# EAGLE design Lux_Meter (EAGLE 9.5.1)

## Sheet 1 of 2
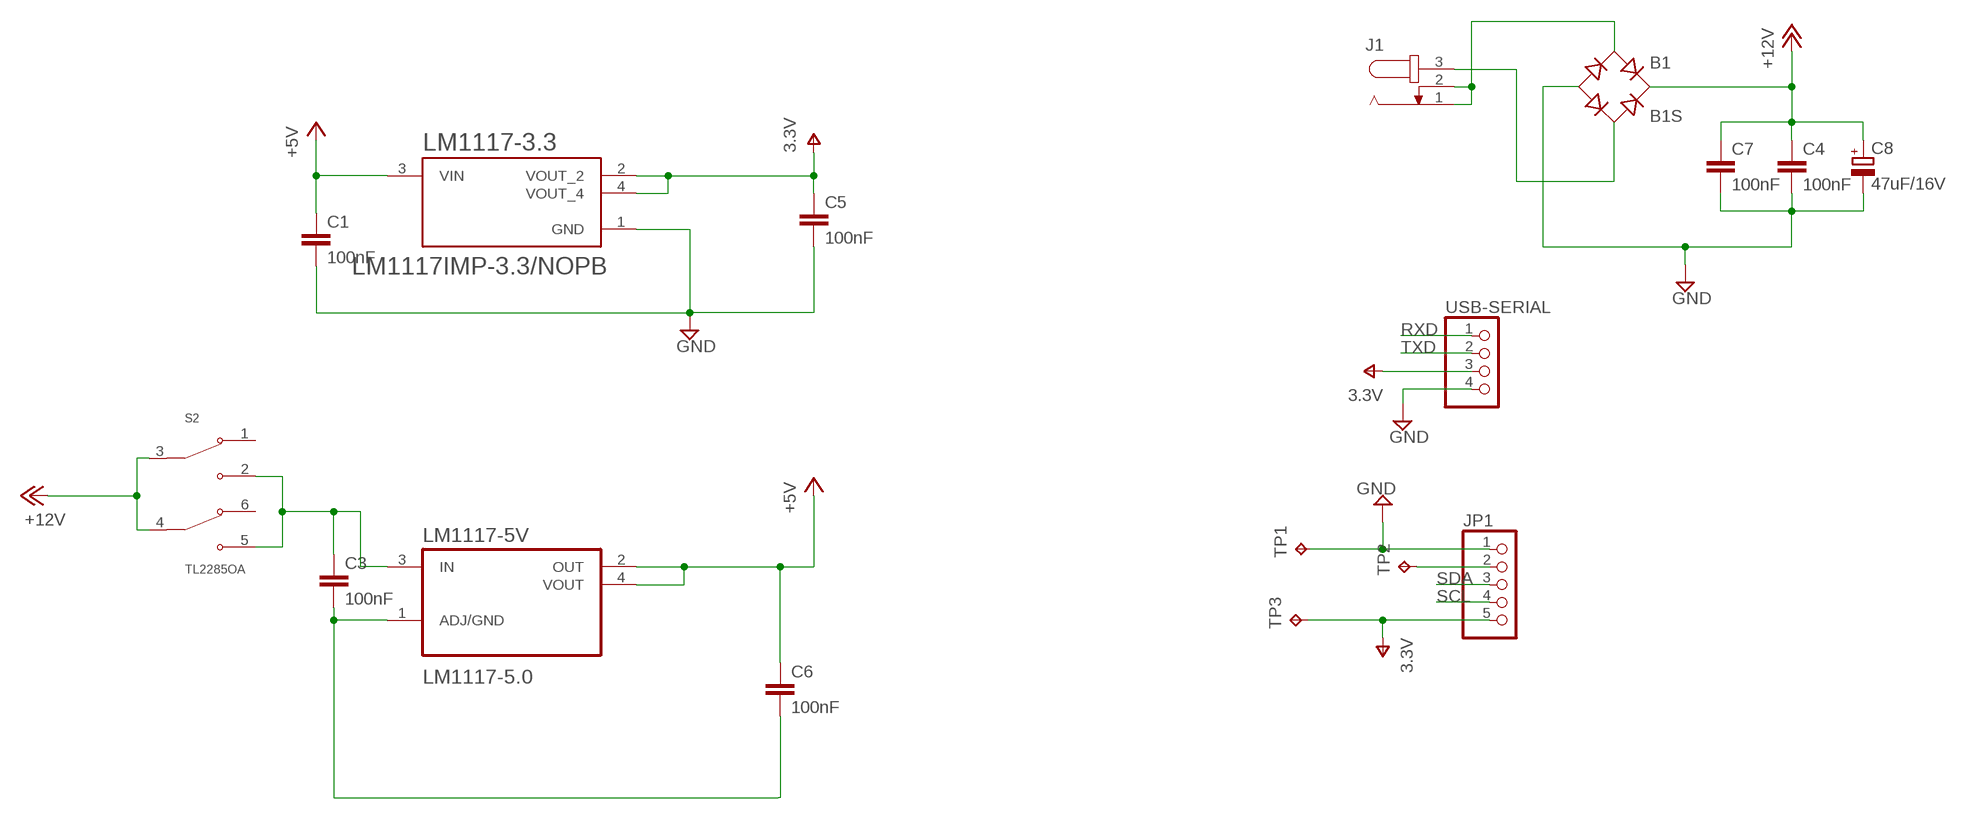
[diagram p0: schematic, sheet 1]

### Parts
B1  B1S  [MBS]
C1  100nF  C-EUC0603K  [C0603K]
C3  100nF  C-EUC0603K  [C0603K]
C4  100nF  C-EUC0603K  [C0603K]
C5  100nF  C-EUC0805K  [C0805K]
C6  100nF  C-EUC0805K  [C0805K]
C7  100nF  C-EUC0805K  [C0805K]
C8  47uF/16V  CPOL-EUC/6032-28R  [C/6032-28R]
J1  JACK-PLUG0  [SPC4077]
JP1  PINHD-1X5  [1X05]
LM1117-3.3  LM1117IMP-3.3/NOPB  [VREG_LM1117IMP-3.3/NOPB]
LM1117-5V  LM1117-5.0  LM1117MP-5.0  [SOT230P700X180-4N]
S2  TL2285OA  [SW_TL2285OA]
TP1  TPTP13SQ  [TP13SQ]
TP2  TPTP13SQ  [TP13SQ]
TP3  TPTP13SQ  [TP13SQ]
USB-SERIAL  PINHD-1X4  [1X04]

### Nets
+5V: C1.1 C6.1 LM1117-3.3.3(VIN) LM1117-5V.2(OUT) LM1117-5V.4(VOUT)
+12V: B1.+ C4.1 C7.1 C8.+ S2.3(COM1) S2.4(COM2)
GND: B1.- C1.2 C4.2 C5.2 C7.2 C8.- JP1.1 LM1117-3.3.1(GND) TP1.TP USB-SERIAL.4 ; also sheet 2
N$6: B1.AC1 J1.1 J1.2
N$7: B1.AC2 J1.3
N$8: JP1.2 TP2.TP
N$10: C3.2 C6.2 LM1117-5V.1(ADJ/GND)
N$23: C3.1 LM1117-5V.3(IN) S2.2(NO1) S2.5(NO2)
RXD: USB-SERIAL.1 ; also sheet 2
SCL: JP1.4 ; also sheet 2
SDA: JP1.3 ; also sheet 2
TXD: USB-SERIAL.2 ; also sheet 2
V+: C5.1 JP1.5 LM1117-3.3.2(VOUT_2) LM1117-3.3.4(VOUT_4) TP3.TP USB-SERIAL.3 ; supply symbol labelled 3.3V ; also sheet 2
Unconnected: S2.1(NC1) S2.6(NC2)

## Sheet 2 of 2
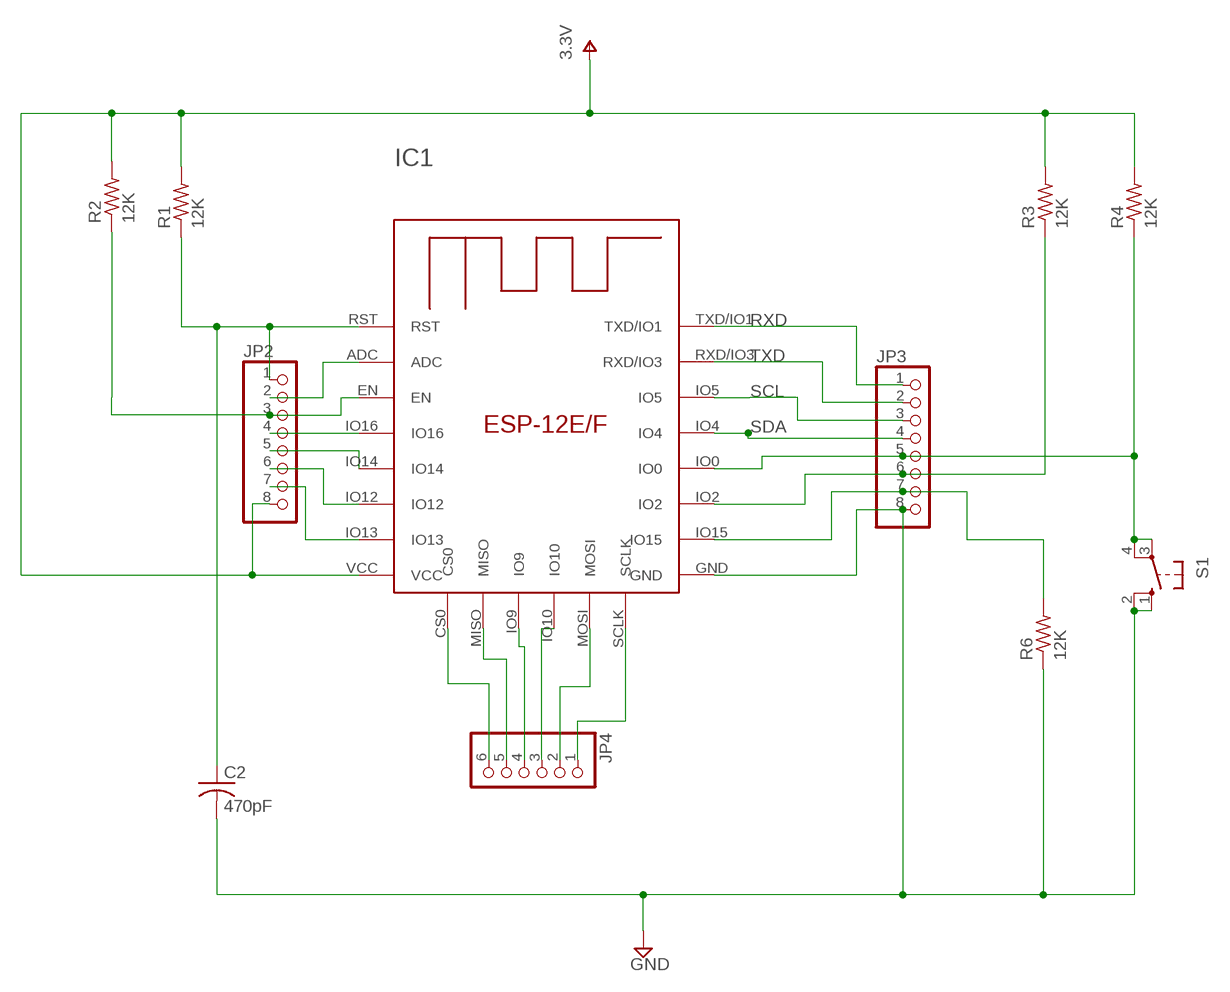
[diagram p1: schematic, sheet 2]

### Parts
C2  470pF  C-USC0805  [C0805]
IC1  ESP-12E/F  [ESP-12E]
JP2  PINHD-1X8  [1X08]
JP3  PINHD-1X8  [1X08]
JP4  PINHD-1X6  [1X06]
R1  12K  R-US_R0805  [R0805]
R2  12K  R-US_R0805  [R0805]
R3  12K  R-US_R0805  [R0805]
R4  12K  R-US_R0805  [R0805]
R6  12K  R-US_R0805  [R0805]
S1  10-XX  [B3F-10XX]

### Nets
GND: C2.2 IC1.GND JP3.8 R6.1 S1.1(S) S1.2(S1) ; also sheet 1
N$1: C2.1 IC1.RST JP2.1 R1.1
N$2: IC1.IO15 JP3.7 R6.2
N$3: IC1.IO0 JP3.5 R4.1 S1.3(P) S1.4(P1)
N$4: IC1.SCLK JP4.1
N$5: IC1.IO2 JP3.6 R3.1
N$11: IC1.ADC JP2.2
N$12: IC1.EN JP2.3 R2.1
N$13: IC1.IO16 JP2.4
N$14: IC1.IO14 JP2.5
N$15: IC1.IO12 JP2.6
N$16: IC1.IO13 JP2.7
N$17: IC1.MOSI JP4.2
N$18: IC1.IO10 JP4.3
N$19: IC1.IO9 JP4.4
N$20: IC1.MISO JP4.5
N$21: IC1.CS0 JP4.6
RXD: IC1.TXD/IO1 JP3.1 ; also sheet 1
SCL: IC1.IO5 JP3.3 ; also sheet 1
SDA: IC1.IO4 JP3.4 ; also sheet 1
TXD: IC1.RXD/IO3 JP3.2 ; also sheet 1
V+: IC1.VCC JP2.8 R1.2 R2.2 R3.2 R4.2 ; supply symbol labelled 3.3V ; also sheet 1

## Library data of the parts
B1 = rectifier:B*S: Surface Mount Glass Passivated Bridge Rectifiers Source: Comchip Bridge Rectifiers B05S-G_B10S-G.pdf
C1 C3-C7 = rcl:C-EU: CAPACITOR, European symbol; SPICEPREFIX: C
C2 = rcl:C-US: CAPACITOR, American symbol; SPICEPREFIX: C
C8 = rcl:CPOL-EU: POLARIZED CAPACITOR, European symbol; SPICEPREFIX: C
IC1 = esp-12e-f:ESP-12E/F
J1 = con-jack:JACK-PLUG: DC POWER JACK Power Jack, DC, Right Angle, Through Hole, Rated 5A at 16VDC, PC Terminals Distributor: Farnell (www.Farnell.de) Drawing: 84N1161.pdf / 84N1162.pdf Manufacturer: SPC Technology (www.spctechnology.com) Type: SPC4077 / SPC 4078; OC_FARNELL: unknown; OC_NEWARK: unknown
JP1 = pinhead:PINHD-1X5: PIN HEADER
JP2 JP3 = pinhead:PINHD-1X8: PIN HEADER
JP4 = pinhead:PINHD-1X6: PIN HEADER
LM1117-3.3 = LM1117IMP-3.3_NOPB:LM1117IMP-3.3/NOPB: 800-mA 15-V linear voltage regulator 4-SOT-223 0 to 125 Check availability <https://pricing.snapeda.com/parts/LM1117IMP-3.3/NOPB/Texas/view-part?ref=eda>; AVAILABILITY: In Stock; DESCRIPTION: 800-mA 15-V linear voltage regulator; MF: Texas; MP: LM1117IMP-3.3/NOPB; PACKAGE: SOT-223-4 Texas Instruments; PRICE: None; PURCHASE-URL: https://pricing.snapeda.com/search/part/LM1117IMP-3.3/NOPB/?ref=eda
LM1117-5V = LM1117MP-5.0:LM1117MP-5.0: Check availability <https://pricing.snapeda.com/parts/LM1117MP-5.0/NOPB/Texas%20Instruments/view-part?ref=eda>; AVAILABILITY: In Stock; DESCRIPTION: 800-mA 15-V linear voltage regulator; MF: Texas Instruments; MP: LM1117MP-5.0/NOPB; PACKAGE: SOT-223-4 Texas Instruments; PRICE: None; PURCHASE-URL: https://pricing.snapeda.com/search/part/LM1117MP-5.0/NOPB/?ref=eda
R1-R4 R6 = rcl:R-US_: RESISTOR, American symbol; SPICEPREFIX: R
S1 = switch-omron:10-XX: OMRON SWITCH; MPN: B3F-1000; OC_FARNELL: 176432; OC_NEWARK: 36M3542
S2 = TL2285OA:TL2285OA: Check availability <https://pricing.snapeda.com/parts/TL2285OA/E-Switch/view-part?ref=eda>; AVAILABILITY: In Stock; DESCRIPTION: Pushbutton Switch DPDT Standard Through Hole; MF: E-Switch; MP: TL2285OA; PACKAGE: None; PRICE: None; PURCHASE-URL: https://pricing.snapeda.com/search/part/TL2285OA/?ref=eda
TP1-TP3 = testpad:TP: Test pad
USB-SERIAL = pinhead:PINHD-1X4: PIN HEADER

## Board
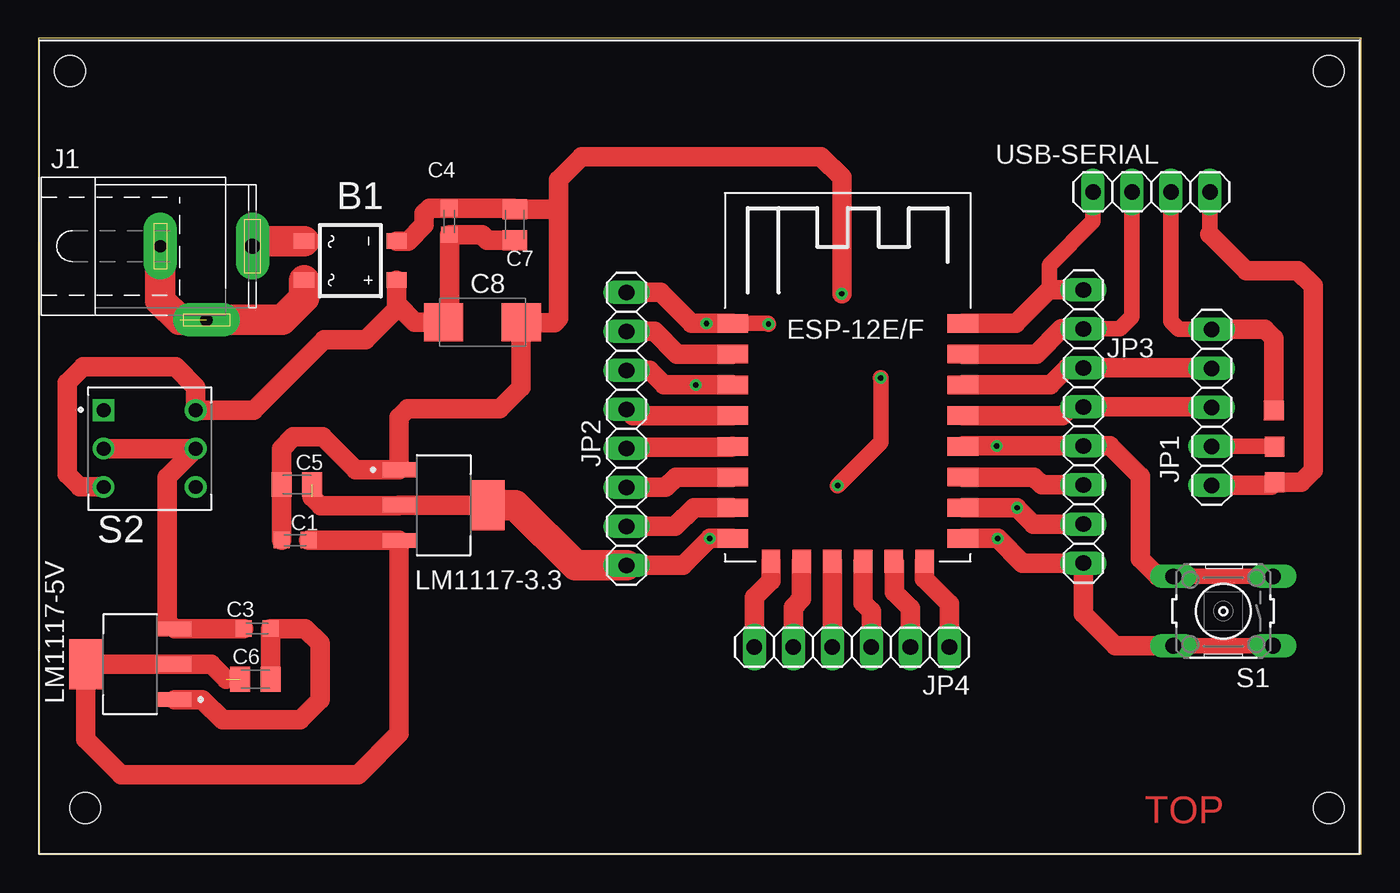
[diagram p2: board, top side]
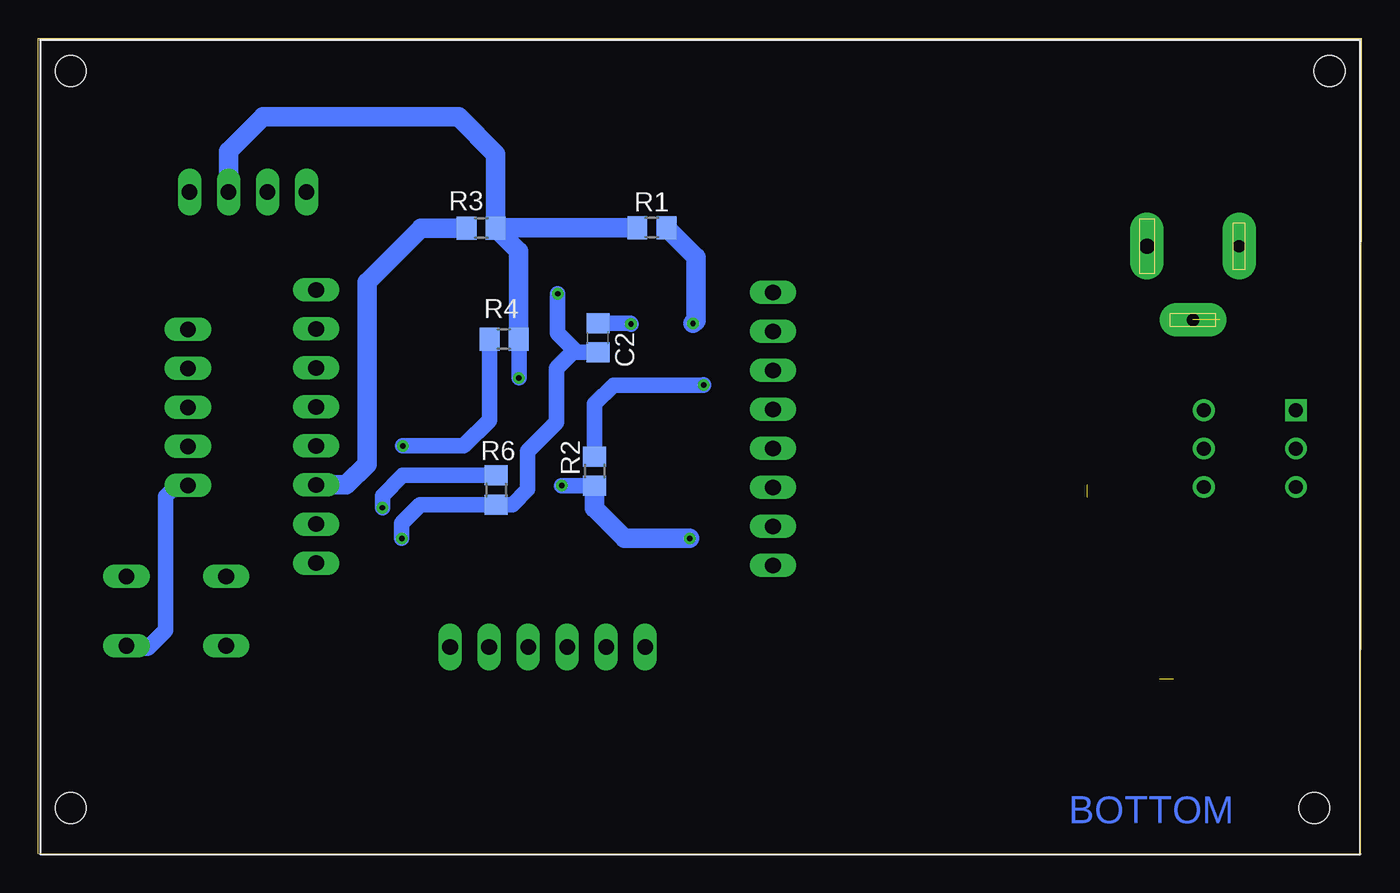
[diagram p3: board, bottom side, seen from below]

Size 86.16 x 53.12 mm. Coordinates in mm from the lower left corner, seen from the top.
Outline: 0.05,0 86.16,0.04 86.16,53.12 0,53.12 0.05,0
Copper layers (1*16): Top 0.035mm / dielectric 1.5mm / Bottom 0.035mm
Design rules "default": minimum track width 6mil, minimum drill 0.35mm, track to track 6mil, track to pad 6mil, pad to pad 6mil, via to via 6mil, smd to smd 6mil, copper to edge 40mil, drill to drill 6mil, minimum pad ring 10mil, minimum via ring 8mil, stop-mask expansion 4mil, vias tented up to drill 0mil, thermal gap 10mil
Holes 2 mm at 2.05,51 84.05,51 3.05,3 84.05,3

### Footprints (pad centres in the part's own frame; a part is rotated, then mirrored left to right if it is on the bottom)
MBS = smd 1 x 1.3: + -1.27,-3; - 1.27,-3; AC1 -1.27,3; AC2 1.27,3
C0603K = smd 1.05 x 1.08: 1 -0.875,0; 2 0.875,0
C0805 = smd 1.3 x 1.5: 1 -0.95,0; 2 0.95,0
C0805K = smd 1.3 x 1.6: 1 -1,0; 2 1,0
C/6032-28R = smd 2.55 x 2.5: + 2.525,0; - -2.525,0
ESP-12E = smd 2 x 1.2: ADC -7.46,5.53; EN -7.46,3.53; GND 7.54,-6.47; IO0 7.54,-0.47; IO2 7.54,-2.47; IO4 7.54,1.53; IO5 7.54,3.53; IO12 -7.46,-2.47; IO13 -7.46,-4.47; IO14 -7.46,-0.47; IO15 7.54,-4.47; IO16 -7.46,1.53; RST -7.46,7.53; RXD/IO3 7.54,5.53; TXD/IO1 7.54,7.53; VCC -7.46,-6.47 | smd 1.2 x 1.5: CS0 -4.96,-7.97; IO9 -0.96,-7.97; IO10 1.04,-7.97; MISO -2.96,-7.97; MOSI 3.04,-7.97; SCLK 5.04,-7.97
SPC4077 = drill 0.8 pad 2.184 long: 1 -3,0; 2 0,-4.8 | drill 1 pad 2.184 long: 3 3,0
1X05 = drill 1.016 long: 1 -5.08,0; 2 -2.54,0; 3 0,0; 4 2.54,0; 5 5.08,0
1X08 = drill 1.016 long: 1 -8.89,0; 2 -6.35,0; 3 -3.81,0; 4 -1.27,0; 5 1.27,0; 6 3.81,0; 7 6.35,0; 8 8.89,0
1X06 = drill 1.016 long: 1 -6.35,0; 2 -3.81,0; 3 -1.27,0; 4 1.27,0; 5 3.81,0; 6 6.35,0
VREG_LM1117IMP-3.3/NOPB = smd 2.15 x 0.95: 1 -2.9,2.3; 2 -2.9,0; 3 -2.9,-2.3 | smd 2.15 x 3.25: 4 2.9,0
SOT230P700X180-4N = smd 2.15 x 0.95: 1 -2.9,2.3; 2 -2.9,0; 3 -2.9,-2.3 | smd 2.15 x 3.25: 4 2.9,0
R0805 = smd 1.3 x 1.5: 1 -0.95,0; 2 0.95,0
B3F-10XX = drill 1.016 long: 1 -3.251,2.261; 2 3.251,2.261; 3 -3.251,-2.261; 4 3.251,-2.261
SW_TL2285OA = drill 0.9 square: 1 -2.5,-3 | drill 0.9: 2 0,-3; 3 2.5,-3; 4 -2.5,3; 5 0,3; 6 2.5,3
TP13SQ = smd 1.3 x 1.3: TP 0,0
1X04 = drill 1.016 long: 1 -3.81,0; 2 -1.27,0; 3 1.27,0; 4 3.81,0

### Placement (x,y rotation side)
B1  20.32,38.65 90 top
C1  16.73,20.45 180 top
C2  49.72,33.63 270 bottom
C3  14.25,14.69 0 top
C4  26.77,41.2 90 top
C5  16.84,24.07 180 top
C6  14.14,11.39 0 top
C7  31.03,40.99 90 top
C8  28.93,34.64 180 top
IC1  52.68,27.03 0 top
J1  10.95,39.59 0 top
JP1  76.42,29.09 90 top
JP2  38.31,27.69 270 top
JP3  68.07,27.85 270 top
JP4  52.99,13.49 180 top
LM1117-3.3  26.4,22.73 0 top
LM1117-5V  5.98,12.37 180 top
R1  46.2,40.8 180 bottom
R2  49.93,24.94 270 bottom
R3  57.32,40.76 0 bottom
R4  55.83,33.54 0 bottom
R6  56.34,23.71 90 bottom
S1  77.18,15.83 180 top
S2  7.25,26.41 270 top
TP1  80.52,24.21 0 top
TP2  80.52,26.54 0 top
TP3  80.47,28.89 0 top
USB-SERIAL  72.5,43.13 0 top

### Tracks (layer width: path | path; a pad name or v marks a point on that pad's centre or on a via)
+5V  (1 unrouted)
  Top 1.27: 12.24,11.39 11.26,12.37 LM1117-5V.2 LM1117-5V.4 3.08,7.48 5.38,5.18 20.82,5.18 23.5,7.86 LM1117-3.3.3 17.62,20.43 C1.1
+12V
  Top 1.27: C7.1 29.24,39.99 28.91,40.33 C4.1 26.77,34.25 26.61,34.09 26.41,34.3 C8.+ 24.51,34.64 23.32,35.83 B1.+ 23.32,35.52 21.31,33.51 18.62,33.51 14.02,28.91 S2.4 10.25,30.42 8.94,31.73 2.91,31.73 1.87,30.69 1.87,24.74 2.7,23.91 S2.3
GND  (via drill 0.35)
  Top 1.016: USB-SERIAL.4 76.31,40.38 | S1.1 S1.2
  Top 1.27: B1.- 24.08,39.92 25.13,40.97 25.13,41.72 25.48,42.08 C4.2 30.95,42.08 C7.2 33.62,41.99 33.89,41.72 | 33.89,41.72 33.89,34.9 33.61,34.62 31.48,34.62 C8.- 31.46,30.41 30.05,29 24.05,29 23.5,28.45 LM1117-3.3.1 20.65,25.03 18.51,27.17 16.61,27.17 15.84,26.4 C5.2 15.84,20.46 C1.2 | S1.2 70.16,13.57 68.07,15.66 JP3.8 64.09,18.96 v62.49,20.56 IC1.GND | v52.33,36.49 52.33,44.07 50.99,45.41 35.37,45.41 33.89,43.93 33.89,41.72 | JP1.1 80.32,24.01 TP1.TP 82.26,24.21 83.05,25 83.05,37 82.05,38 78.69,38 76.31,40.38
  Bottom 1.016: S1.1 80.28,13.42 79.05,13.42 77.88,14.59 77.88,23.3 77.17,24.01 JP1.1 | v52.33,36.49 52.33,33.92 51.09,32.68 C2.2 51.36,32.68 52.4,31.64 52.4,28.12 54.28,26.24 54.28,23.76 55.28,22.76 R6.1 61.29,22.76 62.49,21.56 v62.49,20.56
N$1  (via drill 0.35)
  Top 1.016: v47.56,34.52 47.52,34.56 IC1.RST
  Top 1.27: JP2.1 40.51,36.58 42.53,34.56 v43.52,34.56 IC1.RST
  Bottom 1.016: C2.1 49.7,34.56 47.6,34.56 v47.56,34.52
  Bottom 1.27: R1.1 43.33,38.88 43.33,34.75 v43.52,34.56
N$2  (via drill 0.35)
  Top 1.27: JP3.7 64.81,21.5 v63.75,22.56 IC1.IO15
  Bottom 1.016: v63.75,22.56 63.75,23.34 62.43,24.66 R6.2
N$3  (via drill 0.35)
  Top 1.016: IC1.IO0 60.24,26.58 | S1.4 S1.3
  Top 1.27: 60.24,26.58 v62.43,26.58 JP3.5 69.8,26.58 71.77,24.61 71.77,19.25 72.93,18.09 S1.4
  Bottom 1.016: R4.1 56.78,28.26 58.46,26.58 v62.43,26.58
N$4
  Top 1.27: JP4.1 59.34,16.3 57.72,17.92 IC1.SCLK
N$5
  Top 1.27: IC1.IO2 64.86,24.56 65.38,24.04 JP3.6
  Bottom 1.27: R3.1 61.22,40.76 64.74,37.24 64.74,25.4 66.1,24.04 JP3.6
N$6  (1 unrouted)
  Top 2: J1.1 7.95,36.04 9.2,34.79 | B1.AC1 17.32,36.23 15.88,34.79 J1.2
N$7
  Top 2: J1.3 14.28,39.92 B1.AC2
N$8
  Top 1.016: JP1.2 TP2.TP
N$10
  Top 1.27: C6.2 15.14,14.68 C3.2 17.38,14.69 18.35,13.72 18.35,10.07 17.04,8.76 11.99,8.76 10.68,10.07 LM1117-5V.1
N$11
  Top 1.27: JP2.2 40.12,34.04 41.6,32.56 IC1.ADC
N$12  (via drill 0.35)
  Top 1.27: JP2.3 39.8,31.5 40.74,30.56 v42.82,30.56 IC1.EN
  Bottom 1.016: R2.1 49.93,29.32 48.7,30.55 v42.83,30.55 v42.82,30.56
N$13
  Top 1.27: JP2.4 38.72,28.54 45.2,28.54 IC1.IO16
N$14
  Top 1.27: JP2.5 38.38,26.49 45.15,26.49 IC1.IO14
N$15
  Top 1.27: JP2.6 40.86,23.88 41.54,24.56 IC1.IO12
N$16
  Top 1.27: JP2.7 41.48,21.34 42.7,22.56 IC1.IO13
N$17
  Top 1.27: JP4.2 56.8,16 55.76,17.04 55.76,19.02 IC1.MOSI
N$18
  Top 1.27: JP4.3 54.26,15.82 53.7,16.38 53.7,19.04 IC1.IO10
N$19
  Top 1.27: IC1.IO9 JP4.4
N$20
  Top 1.27: JP4.5 49.18,16.09 49.72,16.63 IC1.MISO
N$21
  Top 1.27: JP4.6 46.64,16.72 47.72,17.8 IC1.CS0
N$23
  Top 1.27: C3.1 13.36,14.67 LM1117-5V.3 8.38,15.17 8.38,24.54 S2.5 S2.2
RXD
  Top 1.016: USB-SERIAL.1 68.69,41.21 65.84,38.36 65.84,36.74
  Top 1.27: JP3.1 65.84,36.74 63.66,34.56 IC1.TXD/IO1
SCL
  Top 1.27: IC1.IO5 65.91,30.56 67.01,31.66 JP3.3 76.39,31.66 JP1.4
SDA
  Top 1.27: IC1.IO4 66.71,28.56 67.27,29.12 JP3.4 76.39,29.12 JP1.3
TXD
  Top 1.016: USB-SERIAL.2 71.23,35 70.43,34.2 JP3.2
  Top 1.27: JP3.2 66.64,34.2 65,32.56 IC1.RXD/IO3
V+  (via drill 0.35)  (1 unrouted)
  Top 1.016: USB-SERIAL.3 73.77,34.7 74.3,34.17 JP1.5 | v52.06,24 54.88,26.82 54.88,31.01 v54.86,31.01
  Top 1.27: 17.84,23.25 18.4,22.69 23.46,22.69 LM1117-3.3.2 LM1117-3.3.4 | JP2.8 41.98,18.8 v43.74,20.56 IC1.VCC | TP3.TP 80.47,33.58 79.88,34.17 JP1.5
  Top 2: LM1117-3.3.4 31.05,22.73 34.98,18.8 JP2.8
  Bottom 1.016: v52.06,24 v52.07,23.99 R2.2 | v54.86,31.01 54.86,33.52 | JP1.5
  Bottom 1.27: R1.2 56.33,40.8 R3.2 | v43.74,20.56 43.76,20.58 47.98,20.58 49.93,22.53 R2.2 | R3.2 54.88,39.27 R4.2 54.86,33.52 | R3.2 56.37,45.59 58.79,48.01 71.53,48.01 73.77,45.77 USB-SERIAL.3

### Text on the board
Top: TOP
Bottom: BOTTOM